# Altium schematic sheet Balanced_LC_Filter.SchDoc: Balanced LC Filter
size A4
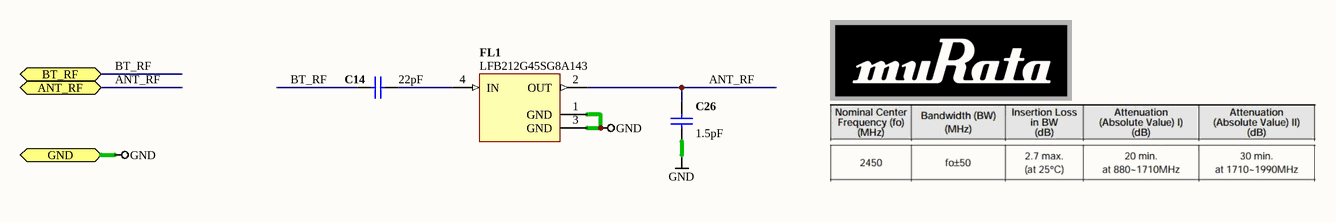
[diagram p0: Balanced_LC_Filter.SchDoc]

## Parts
C14  value 22pF  [CAPC0402(1005)60_N]  (hidden comment: CAP 22pF 16V 0402(1005))
C26  value 1.5pF  [CAPC0402(1005)60_N]  (hidden comment: CAP 1.5pF 10V 0402(1005))
FL1  LFB212G45SG8A143  [MUR-LFB212G45SG8A143-4]

## Ports
ANT_RF, BT_RF, GND

## Nets
GND: C26.1 FL1.1(GND) FL1.3(GND) ; port GND
ANT_RF: C26.2 FL1.2(OUT) ; port ANT_RF
BT_RF: C14.1 ; port BT_RF
NetC14_2: C14.2 FL1.4(IN)

## Notes on the sheet
- Sheet Title
- Project Title
- Size:
- Date:
- A4
- Item:
- Time:
- Revision:
- Sheet
- of
- File:

## Library data of the parts
C14 = CMP-1034-00899-1: CAP 22pF 16V ±0.25pF 0402 (1005 Metric) Thickness 0.6mm SMD; Case-Metric: 1005; Case-EIA: 0402; Rated Voltage: 16 V; Tolerance: ±0.25pF; Technology: SMT; Max Thickness: 0.6 mm
C26 = CMP-1034-00102-1: CAP 1.5pF 10V ±0.1pF 0402 (1005 Metric) Thickness 0.6mm SMD; Case-EIA: 0402; Case-Metric: 1005; Rated Voltage: 10 V; Technology: SMT; Tolerance: ±0.1pF; Max Thickness: 0.6 mm
FL1 = CMP-0453-00001-1: LFB21(0805)_SG Series Filter for Wireless LAN/Bluetooth, 2400-2500 MHz, 2 x 1.25 x 0.95 mm; Manufacturer: Murata; Attenuation (Absolute Value) II) (dB): 30 min. at 1710~1990MHz; Nominal Center Frequency (fo): 2450 MHz; Attenuation (Absolute Value) I) (dB): 20 min. at 880-1710 MHz; Insertion Loss in BW (dB) max: 2.7; Packing: Tape and Reel; Bandwidth (BW): 2450 +/-50MHz; ComponentLink1Description: Manufacturer URL; DatasheetVersion: Dec-10; ComponentLink3Description: Package Specification; ComponentLink1URL: http://www.murata.com/; PartNumber: LFB212G45SG8A143; Mounting Technology: Surface Mount; PackageDescription: 4-Pin Hand drawn, Body 2x1.25mm; ComponentLink2Description: Datasheet; PackageReference: LFB212G45SG8A143-4; ComponentLink2URL: http://www.murata.com/products/catalog/pdf/k99/k99e_l0270.pdf; ComponentLink3URL: http://search.murata.co.jp/Ceramy/CatalogAction.do?sHinnm=?%C2%A0&sNHinnm=LFB212G45SG8A143&sNhin_key=LFB212G45SG8A143&sLang=en&sParam=LFB21